# EAGLE design Quad_layout (EAGLE 9.1.3)
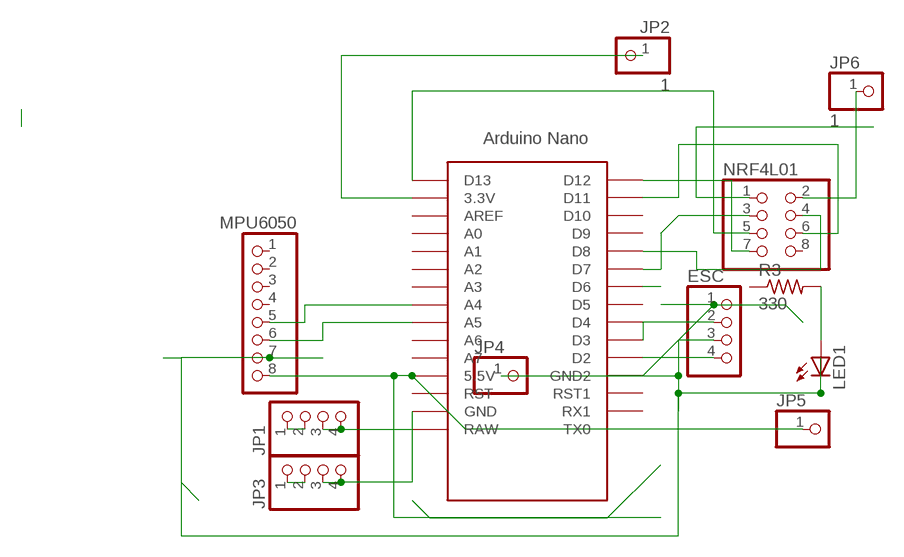
[diagram p0: schematic, sheet 1]

## Parts
ESC  PINHD-1X4  [1X04]
JP1  PINHD-1X4  [1X04]
JP2  1  PINHD-1X1  [1X01]
JP3  PINHD-1X4  [1X04]
JP4  PINHD-1X1  [1X01]
JP5  PINHD-1X1  [1X01]
JP6  1  PINHD-1X1  [1X01]
LED1  LED3MM  [LED3MM]
MPU6050  PINHD-1X8  [1X08]
NRF4L01  PINHD-2X4  [2X04]
R3  330  R-US_0207/10  [0207/10]
U$1  NANO  [NANO]

## Nets
N$1: NRF4L01.4 U$1.D8
N$2: NRF4L01.6 U$1.D11
N$3: JP5.1 MPU6050.8 U$1.5V(5.5V)
N$4: JP1.3 JP1.4 U$1.RAW
N$5: ESC.4 LED1.K(C) MPU6050.7 U$1.GND1(GND2)
N$6: NRF4L01.3
N$7: JP1.1 JP1.2
N$8: ESC.2 U$1.D3
N$10: ESC.3 U$1.D2
N$11: ESC.1 JP4.1
N$13: JP3.3 JP3.4 U$1.GND
N$14: U$1.D6
N$15: NRF4L01.7 U$1.D12
N$16: JP3.1 JP3.2
N$17: LED1.A R3.2
N$18: JP6.1 NRF4L01.2
N$19: NRF4L01.5 U$1.D13
N$20: JP2.1 U$1.3.3V
N$22: NRF4L01.1
N$25: U$1.D7
N$26: MPU6050.5 U$1.A4
N$27: MPU6050.6 U$1.A5
Unconnected: MPU6050.1 MPU6050.2 MPU6050.3 MPU6050.4 NRF4L01.8 R3.1 U$1.A0 U$1.A1 U$1.A2 U$1.A3 U$1.A6 U$1.A7 U$1.AREF U$1.D4 U$1.D5 U$1.D9 U$1.D10 U$1.ICSP1 U$1.ICSP2 U$1.ICSP3 U$1.ICSP4 U$1.ICSP5 U$1.ICSP6 U$1.RST U$1.RST1 U$1.RX1 U$1.TX0

## Library data of the parts
ESC JP1 JP3 = pinhead:PINHD-1X4: PIN HEADER
JP2 JP4-JP6 = pinhead:PINHD-1X1: PIN HEADER
LED1 = led:LED: LED OSRAM: - CHIPLED LG R971, LG N971, LY N971, LG Q971, LY Q971, LO R971, LY R971 LH N974, LH R974 LS Q976, LO Q976, LY Q976 LO Q996 - Hyper CHIPLED LW Q18S LB Q993, LB Q99A, LB R99A - SideLED LS A670, LO A670, LY A670, LG A670, LP A670 LB A673, LV A673, LT A673, LW A673 LH A674 LY A675 LS A676, LA A676, LO A676, LY A676, LW A676 LS A679, LY A679, LG A679 - Hyper Micro SIDELED® LS Y876, LA Y876, LO Y876, LY Y876 LT Y87S - SmartLED LW L88C, LW L88S LB L89C, LB L89S, LG L890 LS L89K, LO L89K, LY L89K LS L896, LA L896, LO L896, LY L896 - TOPLED LS T670, LO T670, LY T670, LG T670, LP T670 LSG T670, LSP T670, LSY T670, LOP T670, LYG T670 LG T671, LOG T671, LSG T671 LB T673, LV T673, LT T673, LW T673 LH T674 LS T676, LA T676, LO T676, LY T676, LB T676, LH T676, LSB T676, LW T676 LB T67C, LV T67C, LT T67C, LS T67K, LO T67K, LY T67K, LW E67C LS E67B, LA E67B, LO E67B, LY E67B, LB E67C, LV E67C, LT E67C LW T67C LS T679, LY T679, LG T679 LS T770, LO T770, LY T770, LG T770, LP T770 LB T773, LV T773, LT T773, LW T773 LH T774 LS E675, LA E675, LY E675, LS T675 LS T776, LA T776, LO T776, LY T776, LB T776 LHGB T686 LT T68C, LB T68C - Hyper Mini TOPLED® LB M676 - Mini TOPLED Santana® LG M470 LS M47K, LO M47K, LY M47K Source: http://www.osram.convergy.de LUXEON: - LUMILED® LXK2-PW12-R00, LXK2-PW12-S00, LXK2-PW14-U00, LXK2-PW14-V00 LXK2-PM12-R00, LXK2-PM12-S00, LXK2-PM14-U00 LXK2-PE12-Q00, LXK2-PE12-R00, LXK2-PE12-S00, LXK2-PE14-T00, LXK2-PE14-U00 LXK2-PB12-K00, LXK2-PB12-L00, LXK2-PB12-M00, LXK2-PB14-N00, LXK2-PB14-P00, LXK2-PB14-Q00 LXK2-PR12-L00, LXK2-PR12-M00, LXK2-PR14-Q00, LXK2-PR14-R00 LXK2-PD12-Q00, LXK2-PD12-R00, LXK2-PD12-S00 LXK2-PH12-R00, LXK2-PH12-S00 LXK2-PL12-P00, LXK2-PL12-Q00, LXK2-PL12-R00 Source: www.luxeon.com KINGBRIGHT: KA-3528ASYC Source: www.kingbright.com
MPU6050 = pinhead:PINHD-1X8: PIN HEADER
NRF4L01 = pinhead:PINHD-2X4: PIN HEADER
R3 = rcl:R-US_: RESISTOR, American symbol; SPICEPREFIX: R
U$1 = Arduino-clone:NANO: Arduino Nano

## Board
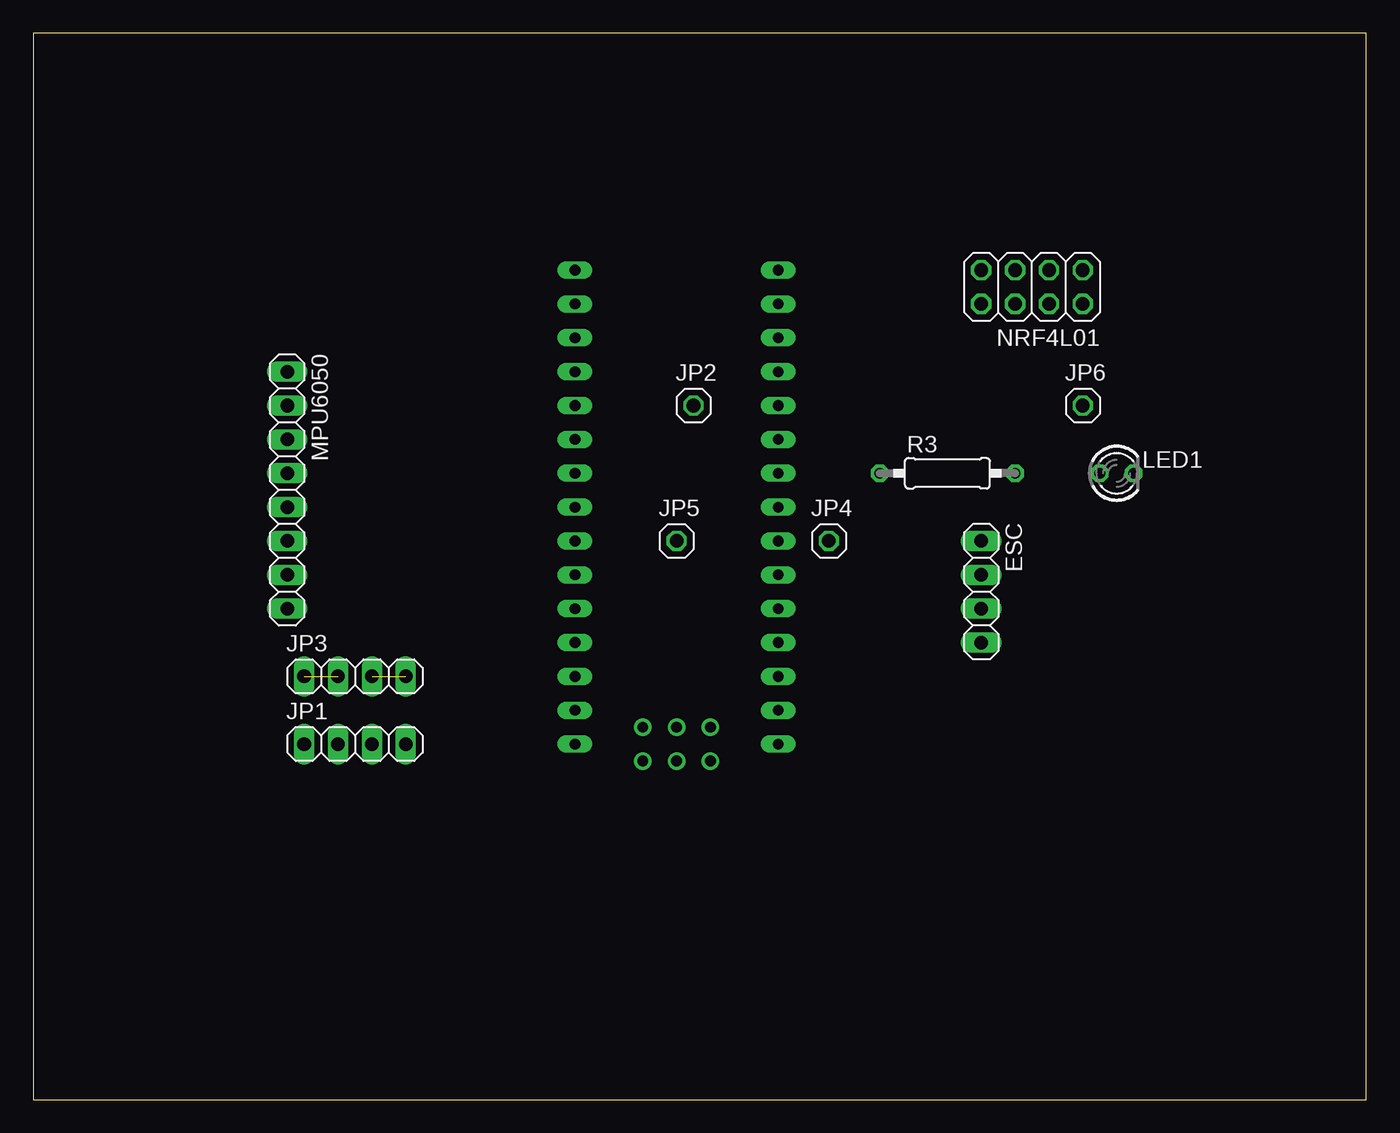
[diagram p1: board, top side]
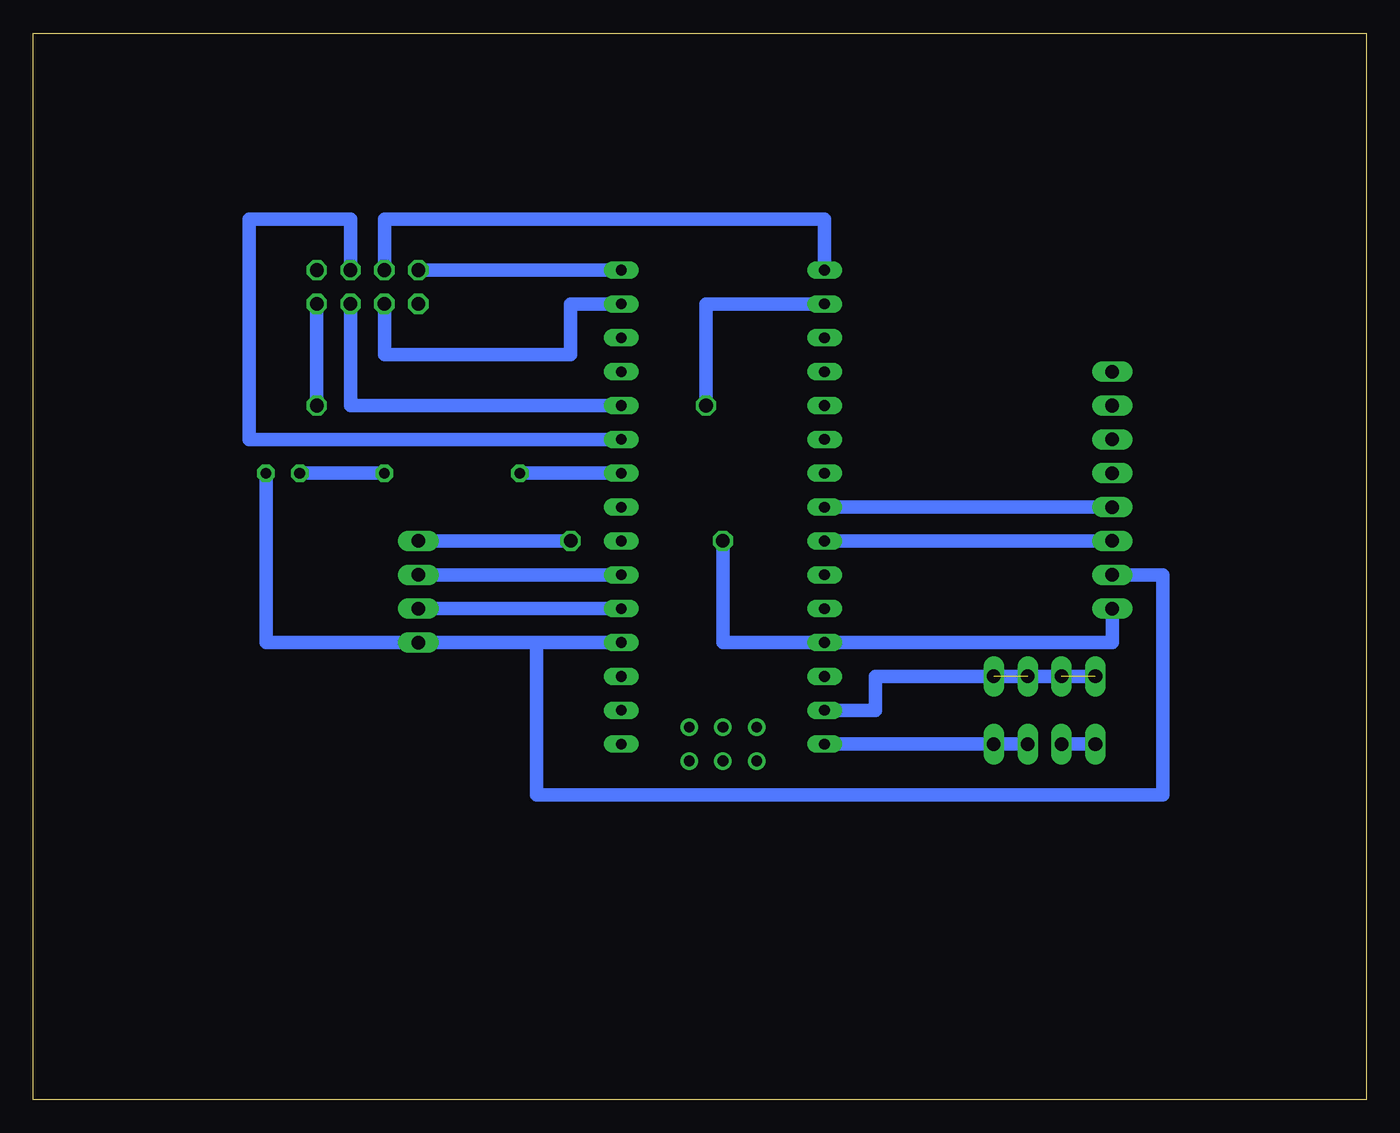
[diagram p2: board, bottom side, seen from below]

Size 100 x 80 mm. Coordinates in mm from the lower left corner, seen from the top.
Outline: 0,0 100,0 100,80 0,80 0,0
Copper layers (1*16): Top 0.035mm / dielectric 1.5mm / Bottom 0.035mm
Design rules "default": minimum track width 6mil, minimum drill 0.35mm, track to track 6mil, track to pad 6mil, pad to pad 6mil, via to via 6mil, smd to smd 6mil, copper to edge 40mil, drill to drill 6mil, minimum pad ring 10mil, minimum via ring 8mil, stop-mask expansion 4mil, vias tented up to drill 0mil, thermal gap 10mil

### Footprints (pad centres in the part's own frame; a part is rotated, then mirrored left to right if it is on the bottom)
1X04 = drill 1.016 long: 1 -3.81,0; 2 -1.27,0; 3 1.27,0; 4 3.81,0
1X01 = drill 1.016 octagon: 1 0,0
LED3MM = drill 0.813 octagon: A -1.27,0; K 1.27,0
1X08 = drill 1.016 long: 1 -8.89,0; 2 -6.35,0; 3 -3.81,0; 4 -1.27,0; 5 1.27,0; 6 3.81,0; 7 6.35,0; 8 8.89,0
2X04 = drill 1.016 octagon: 1 -3.81,-1.27; 2 -3.81,1.27; 3 -1.27,-1.27; 4 -1.27,1.27; 5 1.27,-1.27; 6 1.27,1.27; 7 3.81,-1.27; 8 3.81,1.27
0207/10 = drill 0.813 octagon: 1 -5.08,0; 2 5.08,0
NANO = drill 0.8 long: 3.3V -10.16,24.13; 5V -10.16,-1.27; A0 -10.16,19.05; A1 -10.16,16.51; A2 -10.16,13.97; A3 -10.16,11.43; A4 -10.16,8.89; A5 -10.16,6.35; A6 -10.16,3.81; A7 -10.16,1.27; AREF -10.16,21.59; D2 5.08,1.27; D3 5.08,3.81; D4 5.08,6.35; D5 5.08,8.89; D6 5.08,11.43; D7 5.08,13.97; D8 5.08,16.51; D9 5.08,19.05; D10 5.08,21.59; D11 5.08,24.13; D12 5.08,26.67; D13 -10.16,26.67; GND -10.16,-6.35; GND1 5.08,-1.27; RAW -10.16,-8.89; RST -10.16,-3.81; RST1 5.08,-3.81; RX1 5.08,-6.35; TX0 5.08,-8.89 | drill 0.8: ICSP1 -5.08,-10.16; ICSP2 -5.08,-7.62; ICSP3 -2.54,-10.16; ICSP4 -2.54,-7.62; ICSP5 0,-10.16; ICSP6 0,-7.62

### Placement (x,y rotation side)
ESC  71.12,38.1 270 top
JP1  24.13,26.67 0 top
JP2  49.53,52.07 0 top
JP3  24.13,31.75 0 top
JP4  59.69,41.91 0 top
JP5  48.26,41.91 0 top
JP6  78.74,52.07 0 top
LED1  81.28,46.99 0 top
MPU6050  19.05,45.72 270 top
NRF4L01  74.93,60.96 180 top
R3  68.58,46.99 0 top
U$1  50.8,35.56 0 top

### Tracks (layer width: path | path; a pad name or v marks a point on that pad's centre or on a via)
N$1
  Bottom 1.016: NRF4L01.4 76.2,52.07 U$1.D8
N$2
  Bottom 1.016: NRF4L01.6 73.66,55.88 59.69,55.88 59.69,59.69 U$1.D11
N$3
  Bottom 1.016: MPU6050.8 19.05,34.29 U$1.5V 48.26,34.29 JP5.1
N$4
  Bottom 1.016: U$1.RAW JP1.4 JP1.3
N$5
  Bottom 1.016: MPU6050.7 15.24,39.37 15.24,22.86 62.23,22.86 62.23,34.29 | 62.23,34.29 U$1.GND1 | LED1.K 82.55,34.29 ESC.4 62.23,34.29
N$6
  Bottom 1.016: NRF4L01.3 76.2,66.04 83.82,66.04 83.82,49.53 55.88,49.53
N$7
  Bottom 1.016: JP1.1 JP1.2
N$8
  Bottom 1.016: U$1.D3 ESC.2
N$10
  Bottom 1.016: ESC.3 U$1.D2
N$11
  Bottom 1.016: JP4.1 ESC.1
N$13  (1 unrouted)
  Bottom 1.016: JP3.4 36.83,31.75 36.83,29.21 U$1.GND
N$14
  Bottom 1.016: U$1.D6 63.5,46.99
N$15
  Bottom 1.016: NRF4L01.7 U$1.D12
N$16  (1 unrouted)
  Bottom 1.016: JP3.1 27.94,31.75
N$17
  Bottom 1.016: R3.2 LED1.A
N$18
  Bottom 1.016: NRF4L01.2 JP6.1
N$19
  Bottom 1.016: NRF4L01.5 73.66,66.04 40.64,66.04 U$1.D13
N$20
  Bottom 1.016: U$1.3.3V 49.53,59.69 JP2.1
N$26
  Bottom 1.016: MPU6050.5 U$1.A4
N$27
  Bottom 1.016: MPU6050.6 U$1.A5